# Altium schematic sheet connectors.SchDoc: Terminal Block connectors
size A3; Author: Daniele Basile <asterix@develer.com>; Organization: Altium Limited; Address1: L3, 12a Rodborough Rd; Address2: Frenchs Forest; Address3: NSW; Address4: Australia 2086; DocumentNumber: 1; SheetNumber: 1; SheetTotal: 4; Hw_rev: R1
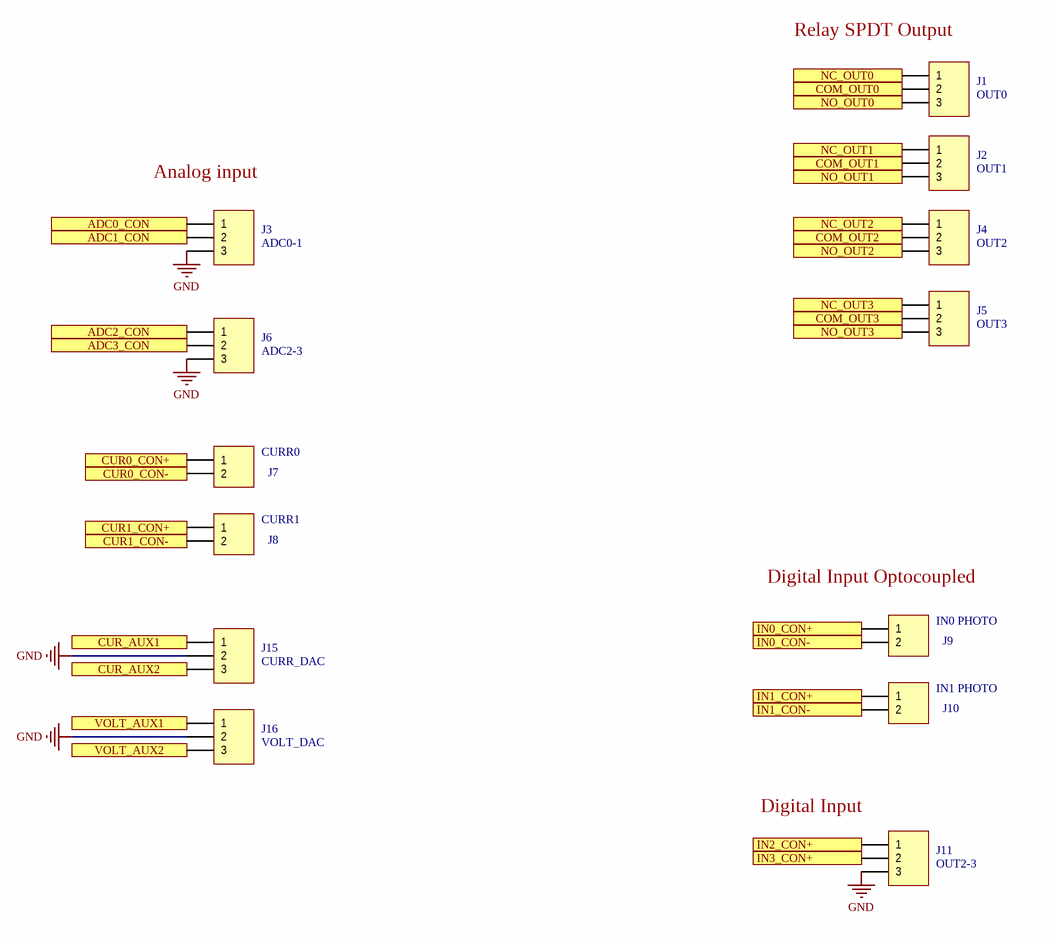
[diagram p0: connectors.SchDoc]

## Parts
J1  OUT0  [TBLOCK_1X3_3.5MM_HOR_THD]
J2  OUT1  [TBLOCK_1X3_3.5MM_HOR_THD]
J3  ADC0-1  [TBLOCK_1X3_3.5MM_HOR_THD]
J4  OUT2  [TBLOCK_1X3_3.5MM_HOR_THD]
J5  OUT3  [TBLOCK_1X3_3.5MM_HOR_THD]
J6  ADC2-3  [TBLOCK_1X3_3.5MM_HOR_THD]
J7  CURR0  [TBLOCK_1X2_3.5MM_HOR_THD]
J8  CURR1  [TBLOCK_1X2_3.5MM_HOR_THD]
J9  IN0 PHOTO  [TBLOCK_1X2_3.5MM_HOR_THD]
J10  IN1 PHOTO  [TBLOCK_1X2_3.5MM_HOR_THD]
J11  OUT2-3  [TBLOCK_1X3_3.5MM_HOR_THD]
J15  CURR_DAC  [TBLOCK_1X3_3.5MM_HOR_THD]
J16  VOLT_DAC  [TBLOCK_1X3_3.5MM_HOR_THD]

## Ports
ADC0_CON, ADC1_CON, ADC2_CON, ADC3_CON, COM_OUT0, COM_OUT1, COM_OUT2, COM_OUT3, CUR0_CON+, CUR0_CON-, CUR1_CON+, CUR1_CON-, CUR_AUX1, CUR_AUX2, IN0_CON+, IN0_CON-, IN1_CON+, IN1_CON-, IN2_CON+, IN3_CON+, NC_OUT0, NC_OUT1, NC_OUT2, NC_OUT3, NO_OUT0, NO_OUT1, NO_OUT2, NO_OUT3, VOLT_AUX1, VOLT_AUX2

## Nets
GND: J3.3 J6.3 J11.3 J15.2 J16.2
ADC0_CON: J3.1 ; port ADC0_CON
ADC1_CON: J3.2 ; port ADC1_CON
ADC2_CON: J6.1 ; port ADC2_CON
ADC3_CON: J6.2 ; port ADC3_CON
COM_OUT0: J1.2 ; port COM_OUT0
COM_OUT1: J2.2 ; port COM_OUT1
COM_OUT2: J4.2 ; port COM_OUT2
COM_OUT3: J5.2 ; port COM_OUT3
CUR0_CON+: J7.1 ; port CUR0_CON+
CUR0_CON-: J7.2 ; port CUR0_CON-
CUR1_CON+: J8.1 ; port CUR1_CON+
CUR1_CON-: J8.2 ; port CUR1_CON-
CUR_AUX1: J15.1 ; port CUR_AUX1
CUR_AUX2: J15.3 ; port CUR_AUX2
IN0_CON+: J9.1 ; port IN0_CON+
IN0_CON-: J9.2 ; port IN0_CON-
IN1_CON+: J10.1 ; port IN1_CON+
IN1_CON-: J10.2 ; port IN1_CON-
IN2_CON+: J11.1 ; port IN2_CON+
IN3_CON+: J11.2 ; port IN3_CON+
NC_OUT0: J1.1 ; port NC_OUT0
NC_OUT1: J2.1 ; port NC_OUT1
NC_OUT2: J4.1 ; port NC_OUT2
NC_OUT3: J5.1 ; port NC_OUT3
NO_OUT0: J1.3 ; port NO_OUT0
NO_OUT1: J2.3 ; port NO_OUT1
NO_OUT2: J4.3 ; port NO_OUT2
NO_OUT3: J5.3 ; port NO_OUT3
VOLT_AUX1: J16.1 ; port VOLT_AUX1
VOLT_AUX2: J16.3 ; port VOLT_AUX2

## Notes on the sheet
- (near J1) Relay SPDT Output
- (near J3) Analog input
- (near J9) Digital Input Optocoupled
- (near J11) Digital Input
- Title:
- Status:
- Author:
- License:
- Project:
- -
- Prj Rev:
- Size:
- A3
- File:
- Date:
- Time:
- Sheet
- of

## Library data of the parts
J1-J6 J11 J15 J16 = Header 3: Terminal block Header 3.5mm Horizonta; LatestRevisionDate: 17-Jul-2002; LatestRevisionNote: Re-released for DXP Platform.; Publisher: Altium Limited
J7-J10 = Header 2: Terminal block Header 3.5mm Horizontal (WE 691322110002); LatestRevisionDate: 17-Jul-2002; LatestRevisionNote: Re-released for DXP Platform.; Publisher: Altium Limited